# Altium schematic sheet M_Board_2011.SchDoc
size A4
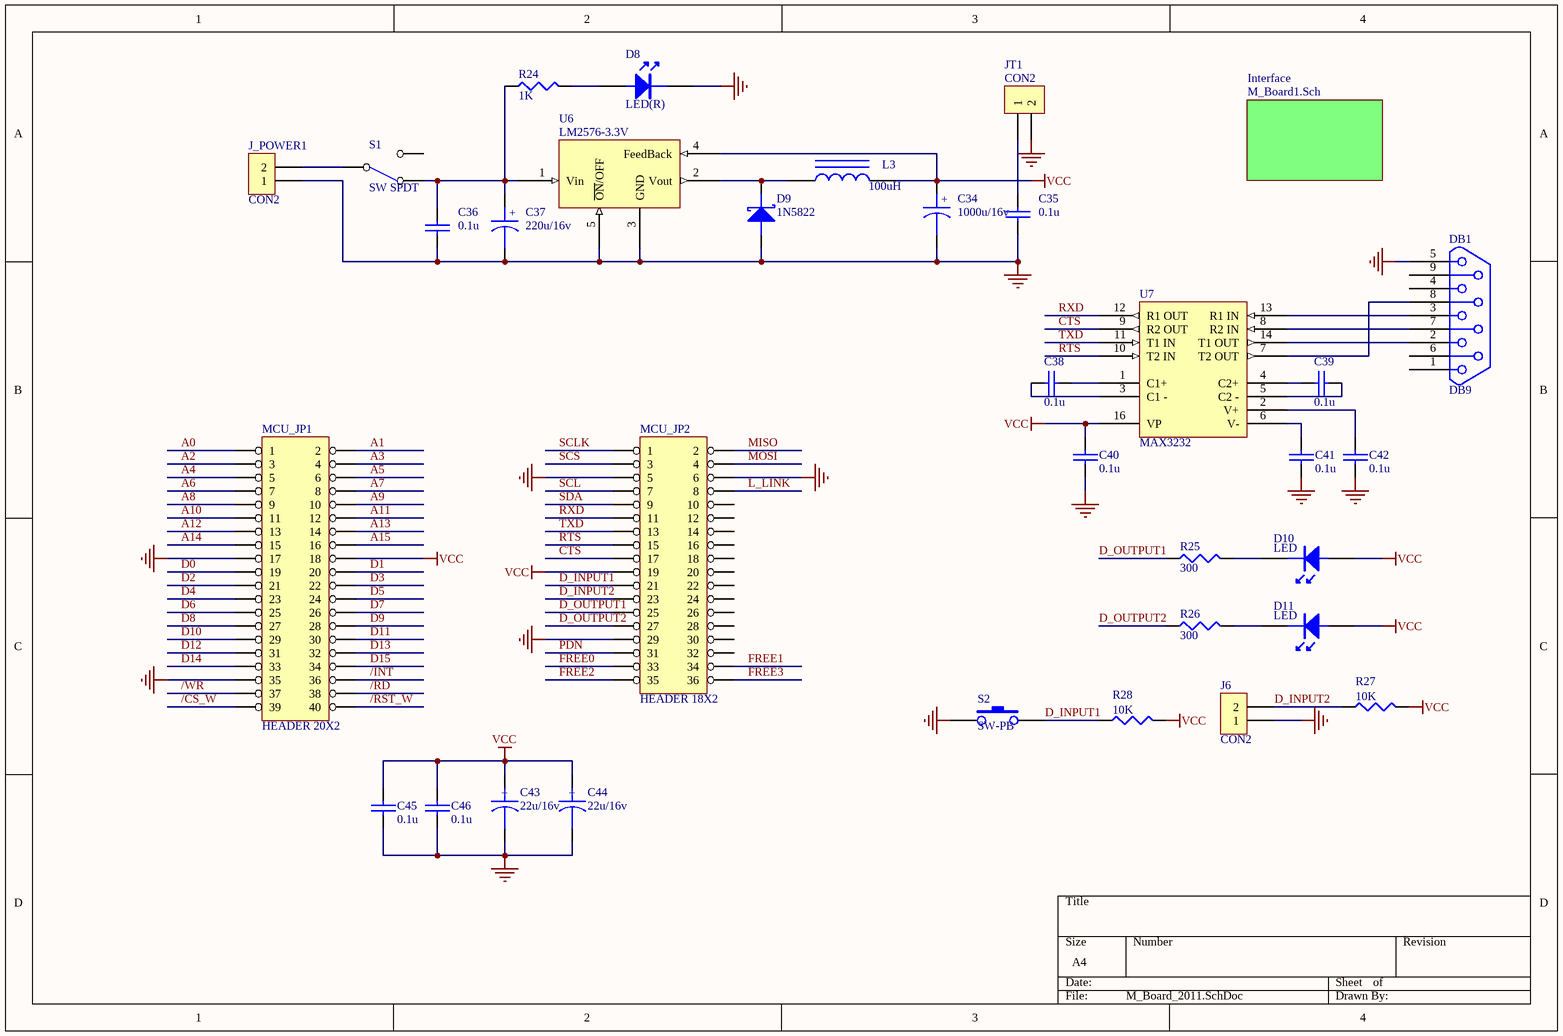
[diagram p0: M_Board_2011.SchDoc]

## Parts
C34  1000u/16v  [RB.2/.4]
C35  0.1u  [0603]
C36  0.1u  [0603]
C37  220u/16v  [RB.2/.4]
C38  0.1u  [0603]
C39  0.1u  [0603]
C40  0.1u  [0603]
C41  0.1u  [0603]
C42  0.1u  [0603]
C43  22u/16v  [RB.1/.2N]
C44  22u/16v  [RB.1/.2N]
C45  0.1u  [0603]
C46  0.1u  [0603]
D8  LED(R)  [LED2P]
D9  1N5822  [1005]
D10  LED  [LED2P]
D11  LED  [LED2P]
DB1  DB9  [DB9/F]
J6  CON2  [SIP2]
J_POWER1  CON2  [PLUG]
JT1  CON2  [SIP2]
L3  100uH  [BED]
MCU_JP1  HEADER 20X2  [IDC40-2]
MCU_JP2  HEADER 18X2  [IDC36-2]
R24  1K  [0603]
R25  300  [0603]
R26  300  [0603]
R27  10K  [0603]
R28  10K  [0603]
S1  SW SPDT  [SWITCH-3]
S2  SW-PB  [SW-4]
U6  LM2576-3.3V  [DPAK-5]
U7  MAX3232  [SO-16]

## Sub-sheets
Interface = M_Board1.Sch: no entries  | Description: Interface

## Nets
GND: C34.2 C35.2 C36.2 C37.2 C40.2 C41.2 C42.2 C43.2 C44.2 C45.1 C46.1 D8.K D9.1(A) DB1.5 J6.1 J_POWER1.1 JT1.2 MCU_JP1.17 MCU_JP1.35 MCU_JP2.5 MCU_JP2.6 MCU_JP2.29 S2.1 U6.3(GND) U6.5(~{ON}/OFF) U7.15(GND)
VCC: C34.1 C40.1 C43.1 C44.1 C45.2 C46.2 D10.A D11.A L3.2 MCU_JP1.18 MCU_JP2.19 R27.2 R28.2 U6.4(FeedBack) U7.16(VP)
/CS_W: MCU_JP1.39
/INT: MCU_JP1.36
/RD: MCU_JP1.38
/RST_W: MCU_JP1.40
/WR: MCU_JP1.37
A0: MCU_JP1.1
A1: MCU_JP1.2
A2: MCU_JP1.3
A3: MCU_JP1.4
A4: MCU_JP1.5
A5: MCU_JP1.6
A6: MCU_JP1.7
A7: MCU_JP1.8
A8: MCU_JP1.9
A9: MCU_JP1.10
A10: MCU_JP1.11
A11: MCU_JP1.12
A12: MCU_JP1.13
A13: MCU_JP1.14
A14: MCU_JP1.15
A15: MCU_JP1.16
CTS: MCU_JP2.17 U7.9(R2_OUT)
D0: MCU_JP1.19
D1: MCU_JP1.20
D2: MCU_JP1.21
D3: MCU_JP1.22
D4: MCU_JP1.23
D5: MCU_JP1.24
D6: MCU_JP1.25
D7: MCU_JP1.26
D8: MCU_JP1.27
D9: MCU_JP1.28
D10: MCU_JP1.29
D11: MCU_JP1.30
D12: MCU_JP1.31
D13: MCU_JP1.32
D14: MCU_JP1.33
D15: MCU_JP1.34
D_INPUT1: MCU_JP2.21 R28.1 S2.2
D_INPUT2: J6.2 MCU_JP2.23 R27.1
D_OUTPUT1: MCU_JP2.25 R25.1
D_OUTPUT2: MCU_JP2.27 R26.1
FREE0: MCU_JP2.33
FREE1: MCU_JP2.34
FREE2: MCU_JP2.35
FREE3: MCU_JP2.36
L_LINK: MCU_JP2.8
MISO: MCU_JP2.2
MOSI: MCU_JP2.4
PDN: MCU_JP2.31
RTS: MCU_JP2.15 U7.10(T2_IN)
RXD: MCU_JP2.11 U7.12(R1_OUT)
SCL: MCU_JP2.7
SCLK: MCU_JP2.1
SCS: MCU_JP2.3
SDA: MCU_JP2.9
TXD: MCU_JP2.13 U7.11(T1_IN)
NetC35_1: C35.1 JT1.1
NetC36_1: C36.1 C37.1 R24.1 S1.2(NC) U6.1(Vin)
NetC38_1: C38.1 U7.3(C1_-)
NetC38_2: C38.2 U7.1(C1+)
NetC39_1: C39.1 U7.4(C2+)
NetC39_2: C39.2 U7.5(C2_-)
NetC41_1: C41.1 U7.6(V-)
NetC42_1: C42.1 U7.2(V+)
NetD8_A: D8.A R24.2
NetD9_2: D9.2(K) L3.1 U6.2(Vout)
NetD10_K: D10.K R25.2
NetD11_K: D11.K R26.2
NetDB1_2: DB1.2 U7.14(T1_OUT)
NetDB1_3: DB1.3 U7.13(R1_IN)
NetDB1_7: DB1.7 U7.8(R2_IN)
NetDB1_8: DB1.8 U7.7(T2_OUT)
NetJ_POWER1_2: J_POWER1.2 S1.1(COMMON)

Not connected (* = marked no-connect by the designer): DB1 1 4 6 9; MCU_JP2 10 12 14 16 18 20 22 24 26 28 30 32; S1 3(NO)

## Notes on the sheet
- (in symbol CAPACITOR POL) +

## Library data of the parts
C34 C37 C43 C44 = CAPACITOR POL: Capacitor
C35 C36 C38-C42 C45 C46 = CAP: Capacitor
D8 = LED
D9 = DIODE SCHOTTKY: Schottky Diode
DB1 = ICHIP3.S01_DB9_1
J6 J_POWER1 JT1 = CON2: Connector
L3 = INDUCTOR IRON
R24-R28 = RES1
U6 = LM2576
U7 = MAX232ACPE(16): +-15KV ESD-PROTECTED, +5V RS-232 TRANSCEIVERS